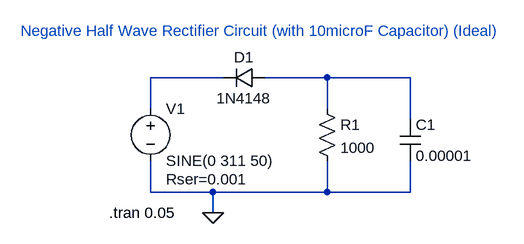
[diagram p0: schematic Assignment 3b (v).asc]
Assignment 3b (v).asc, the LTspice schematic file:
Version 4.1
SHEET 1 880 680
WIRE 304 80 192 80
WIRE 464 80 368 80
WIRE 592 80 464 80
WIRE 192 128 192 80
WIRE 464 128 464 80
WIRE 592 144 592 80
WIRE 192 256 192 208
WIRE 288 256 192 256
WIRE 464 256 464 208
WIRE 464 256 288 256
WIRE 592 256 592 208
WIRE 592 256 464 256
WIRE 288 288 288 256
FLAG 288 288 0
SYMBOL voltage 192 112 R0
WINDOW 123 0 0 Left 2
WINDOW 39 24 124 Left 2
SYMATTR SpiceLine Rser=0.001
SYMATTR InstName V1
SYMATTR Value SINE(0 311 50)
SYMBOL res 448 112 R0
SYMATTR InstName R1
SYMATTR Value 1000
SYMBOL diode 368 64 R90
WINDOW 0 0 32 VBottom 2
WINDOW 3 32 32 VTop 2
SYMATTR InstName D1
SYMATTR Value 1N4148
SYMBOL cap 576 144 R0
SYMATTR InstName C1
SYMATTR Value 0.00001
TEXT 128 288 Left 2 !.tran 0.05
TEXT -8 8 Left 2 ;Negative Half Wave Rectifier Circuit (with 10microF Capacitor) (Ideal)

The netlist it stands for:
* Assignment 3b (v).asc
V1 N001 0 SINE(0 311 50) Rser=0.001
R1 N002 0 1000
D1 N002 N001 1N4148
C1 N002 0 0.00001
.model D D
.lib standard.dio
.tran 0.05
* Negative Half Wave Rectifier Circuit (with 10microF Capacitor) (Ideal)
.backanno
.end